# EAGLE design uCopter (EAGLE 7.5.0)
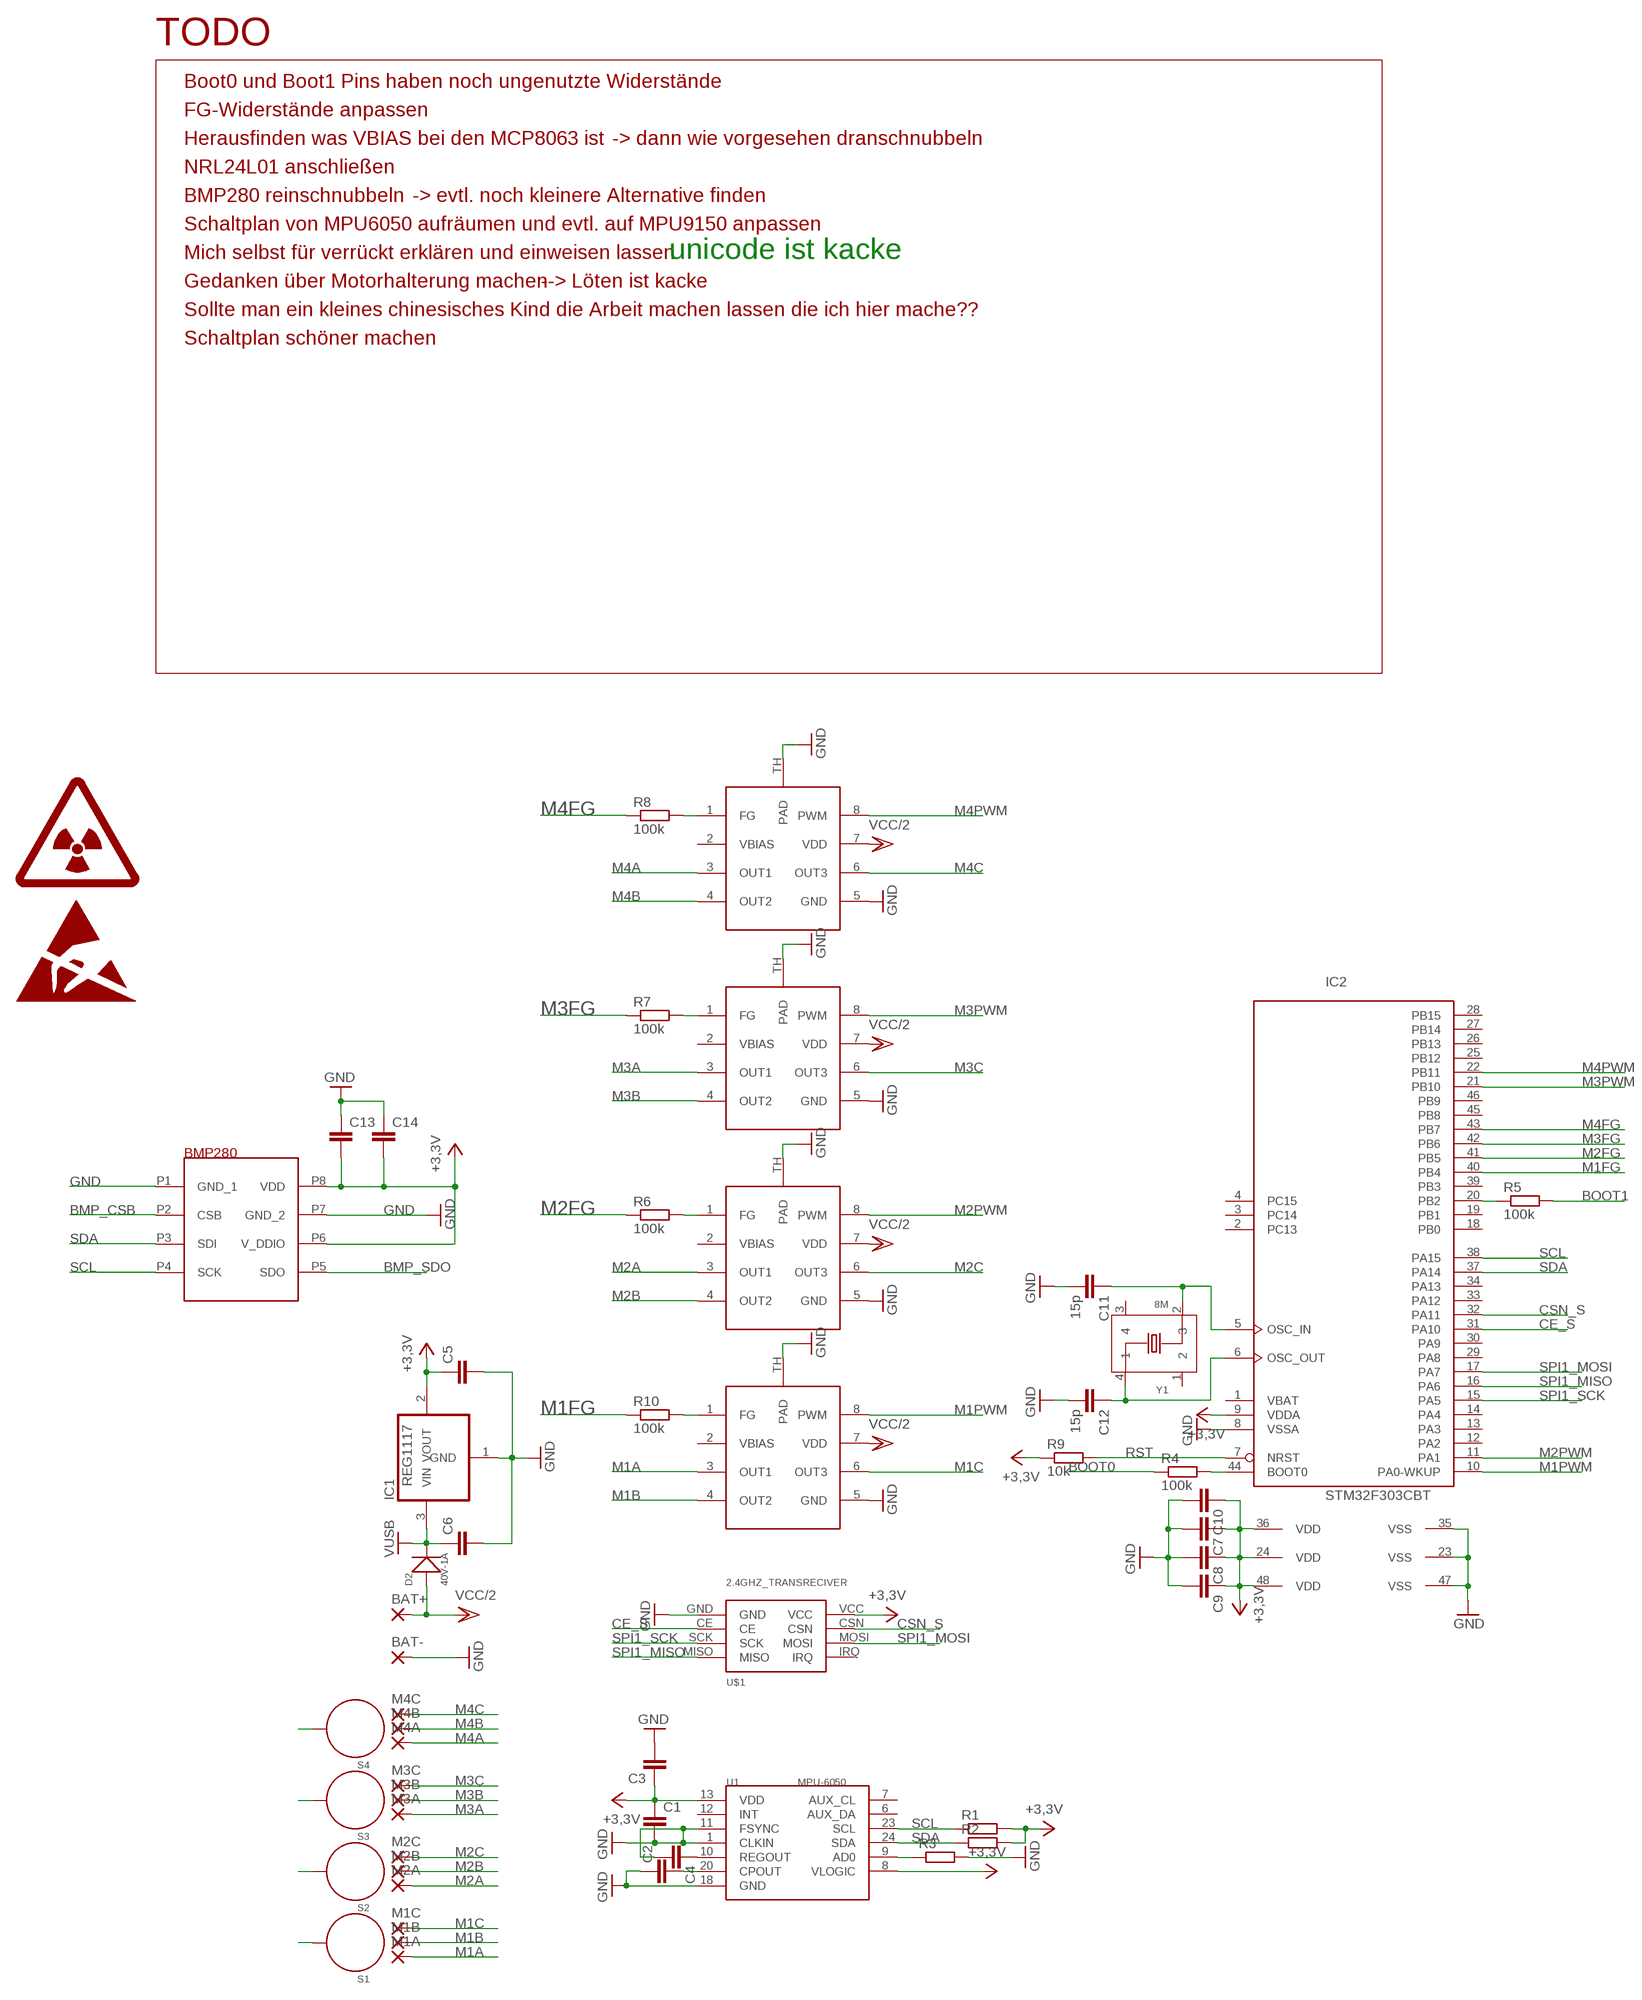
[diagram p0: schematic, sheet 1]

## Parts
BAT+  SMD2  [SMD1,27-2,54]
BAT-  SMD2  [SMD1,27-2,54]
C1  C-EUC0402  [C0402]
C2  C-EUC0402  [C0402]
C3  C-EUC0402  [C0402]
C4  C-EUC0402  [C0402]
C5  C-EUC0603  [C0603]
C6  C-EUC0603  [C0603]
C7  C-EUC0402  [C0402]
C8  C-EUC0402  [C0402]
C9  C-EUC0402  [C0402]
C10  C-EUC0402  [C0402]
C11  15p  C-EUC0402  [C0402]
C12  15p  C-EUC0402  [C0402]
C13  C-EUC0402  [C0402]
C14  C-EUC0402  [C0402]
D2  40V-1A  SMD-DIODE-SCHOTTKY-40V-1A(DO-214AC)  [DO-214AC]
IC1  REG1117  [SOT223]
IC2  STM32F303CBT  [LQFP48]
M1A  2,15/1,0  [2,15/1,0]
M1B  2,15/1,0  [2,15/1,0]
M1C  2,15/1,0  [2,15/1,0]
M2A  2,15/1,0  [2,15/1,0]
M2B  2,15/1,0  [2,15/1,0]
M2C  2,15/1,0  [2,15/1,0]
M3A  2,15/1,0  [2,15/1,0]
M3B  2,15/1,0  [2,15/1,0]
M3C  2,15/1,0  [2,15/1,0]
M4A  2,15/1,0  [2,15/1,0]
M4B  2,15/1,0  [2,15/1,0]
M4C  2,15/1,0  [2,15/1,0]
R1  R-EU_R0402  [R0402]
R2  R-EU_R0402  [R0402]
R3  R-EU_R0402  [R0402]
R4  100k  R-EU_R0402  [R0402]
R5  100k  R-EU_R0402  [R0402]
R6  100k  R-EU_R0402  [R0402]
R7  100k  R-EU_R0402  [R0402]
R8  100k  R-EU_R0402  [R0402]
R9  10k  R-EU_R0402  [R0402]
R10  100k  R-EU_R0402  [R0402]
S1  STANDOFF_ELECTRICAL  [STANDOFF-ELECTRICAL]
S2  STANDOFF_ELECTRICAL  [STANDOFF-ELECTRICAL]
S3  STANDOFF_ELECTRICAL  [STANDOFF-ELECTRICAL]
S4  STANDOFF_ELECTRICAL  [STANDOFF-ELECTRICAL]
T1  BMP280  [BMP280]
U1  MPU-6050  MOTION/POSITION-MPU-6050(QFN24)  [QFN24G-0.5-4X4MM]
U$1  2.4GHZ_TRANSRECIVER  [2.4GHZ_TRANSRECIVER]
U$6  MCP8063  [DFN8-4X4]
U$7  MCP8063  [DFN8-4X4]
U$8  MCP8063  [DFN8-4X4]
U$9  MCP8063  [DFN8-4X4]
Y1  8M  SMD-CRYSTAL-27.12MHZ-18PF-30PPM-60R(4P-3.2X2.5MM)  [X4-SMD-3.2X2.5X0.7MM]

## Nets
+3,3V: C1.1 C3.1 C5.1 C7.1 C8.1 C9.1 C10.1 C13.2 C14.2 IC1.2(VOUT) IC2.9(VDDA) IC2.24(VDD) IC2.36(VDD) IC2.48(VDD) R1.2 R2.2 R9.1 T1.P6(V_DDIO) T1.P8(VDD) U1.8(VLOGIC) U1.13(VDD) U$1.VCC
BMP_CSB: T1.P2(CSB)
BMP_SDO: T1.P5(SDO)
BOOT0: R4.1
BOOT1: R5.2
CE_S: IC2.31(PA10) U$1.CE
CSN_S: IC2.32(PA11) U$1.CSN
GND: BAT-.1(P) C1.2 C2.1 C3.2 C4.2 C5.2 C6.2 C7.2 C8.2 C9.2 C10.2 C11.2 C12.2 C13.1 C14.1 IC1.1(GND) IC2.8(VSSA) IC2.23(VSS) IC2.35(VSS) IC2.47(VSS) R3.2 T1.P1(GND_1) T1.P7(GND_2) U1.1(CLKIN) U1.11(FSYNC) U1.18(GND) U$1.GND U$6.5(GND) U$6.TH(PAD) U$7.5(GND) U$7.TH(PAD) U$8.5(GND) U$8.TH(PAD) U$9.5(GND) U$9.TH(PAD)
M1A: M1A.1(P) U$6.3(OUT1)
M1B: M1B.1(P) U$6.4(OUT2)
M1C: M1C.1(P) U$6.6(OUT3)
M1FG: IC2.40(PB4) R10.1
M1PWM: IC2.10(PA0-WKUP) U$6.8(PWM)
M2A: M2A.1(P) U$7.3(OUT1)
M2B: M2B.1(P) U$7.4(OUT2)
M2C: M2C.1(P) U$7.6(OUT3)
M2FG: IC2.41(PB5) R6.1
M2PWM: IC2.11(PA1) U$7.8(PWM)
M3A: M3A.1(P) U$8.3(OUT1)
M3B: M3B.1(P) U$8.4(OUT2)
M3C: M3C.1(P) U$8.6(OUT3)
M3FG: IC2.42(PB6) R7.1
M3PWM: IC2.21(PB10) U$8.8(PWM)
M4A: M4A.1(P) U$9.3(OUT1)
M4B: M4B.1(P) U$9.4(OUT2)
M4C: M4C.1(P) U$9.6(OUT3)
M4FG: IC2.43(PB7) R8.1
M4PWM: IC2.22(PB11) U$9.8(PWM)
N$1: S4.P1
N$2: S3.P1
N$3: S2.P1
N$4: S1.P1
N$5: R7.2 U$8.1(FG)
N$6: R8.2 U$9.1(FG)
N$7: C4.1 U1.10(REGOUT)
N$8: C2.2 U1.20(CPOUT)
N$9: R3.1 U1.9(AD0)
N$10: IC2.44(BOOT0) R4.2
N$11: IC2.20(PB2) R5.1
N$12: R10.2 U$6.1(FG)
N$13: C12.1 IC2.6(OSC_OUT) Y1.4
N$14: R6.2 U$7.1(FG)
N$17: C11.1 IC2.5(OSC_IN) Y1.2
RST: IC2.7(NRST) R9.2
SCL: IC2.38(PA15) R1.1 T1.P4(SCK) U1.23(SCL)
SDA: IC2.37(PA14) R2.1 T1.P3(SDI) U1.24(SDA)
SPI1_MISO: IC2.16(PA6) U$1.MISO
SPI1_MOSI: IC2.17(PA7) U$1.MOSI
SPI1_SCK: IC2.15(PA5) U$1.SCK
VCC/2: BAT+.1(P) D2.1(+) U$6.7(VDD) U$7.7(VDD) U$8.7(VDD) U$9.7(VDD)
VUSB: C6.1 D2.2(-) IC1.3(VIN)
Unconnected: IC2.2(PC13) IC2.3(PC14) IC2.4(PC15) IC2.12(PA2) IC2.13(PA3) IC2.14(PA4) IC2.18(PB0) IC2.19(PB1) IC2.25(PB12) IC2.26(PB13) IC2.27(PB14) IC2.28(PB15) IC2.29(PA8) IC2.30(PA9) IC2.33(PA12) IC2.34(PA13) IC2.39(PB3) IC2.45(PB8) IC2.46(PB9) U1.6(AUX_DA) U1.7(AUX_CL) U1.12(INT) U$1.IRQ U$6.2(VBIAS) U$7.2(VBIAS) U$8.2(VBIAS) U$9.2(VBIAS) Y1.1 Y1.3

## Notes on the sheet
- TODO
- Boot0 und Boot1 Pins haben noch ungenutzte Widerstände
- FG-Widerstände anpassen
- Herausfinden was VBIAS bei den MCP8063 ist | -> dann wie vorgesehen dranschnubbeln
- NRL24L01 anschließen
- BMP280 reinschnubbeln | -> evtl. noch kleinere Alternative finden
- Schaltplan von MPU6050 aufräumen und evtl. auf MPU9150 anpassen
- Mich selbst für verrückt erklären und einweisen lassen | unicode ist kacke
- Gedanken über Motorhalterung machen | --> Löten ist kacke
- Sollte man ein kleines chinesisches Kind die Arbeit machen lassen die ich hier mache??
- Schaltplan schöner machen

## Power pins joined to a net without a drawn wire
VBAT: IC2.1(VBAT)

## Library data of the parts
BAT+ BAT- = wirepad:SMD2: SMD PAD
C1-C14 = rcl:C-EU: CAPACITOR, European symbol
D2 = Seeed-OPL-Diode:SMD-DIODE-SCHOTTKY-40V-1A(DO-214AC): 304020027; MPN: 1N5819
IC1 = burr-brown:REG1117: 800mA and 1A Low Dropout (LDO) Positive Regulator 1.8V, 2.5V, 2.85V, 3.3V, 5V, and Adj
IC2 = micro-stm_v2:STM32F303C*T: ARM 32-bit Cortex™-M3 CPU 72 MHz maximum frequency 128 to 256 Kbytes of Flash memory 32 to 40 kbytes of SRAM 37 GPIOs 2.0 to 3.6 V application supply
M1A M1B M1C M2A M2B M2C M3A M3B M3C M4A M4B M4C = wirepad:2,15/1,0: THROUGH-HOLE PAD
R1-R10 = rcl:R-EU_: RESISTOR, European symbol
S1-S4 = SparkFun-Electromechanical:STANDOFF_ELECTRICAL: A standoff intended to be an electrically connected point. Pad size and stop size allow for a #4 Phillips pan screw head to make a solid connection to the board.
T1 = BOSCH-Testbuilds:BMP280: Test-Foodprint BMP280
U1 = Seeed-OPL-sensor:MOTION/POSITION-MPU-6050(QFN24): 314080000; MPN: MPU-6050
U$1 = 2_4GHZTransreciver:2.4GHZ_TRANSRECIVER
U$6-U$9 = mcp8063:MCP8063
Y1 = Seeed-OPL-Crystal-Oscillator:SMD-CRYSTAL-27.12MHZ-18PF-30PPM-60R(4P-3.2X2.5MM): 306010027; MPN: 7M-27.120MAAJ-T; VALUE: 27.12MHZ

## Board
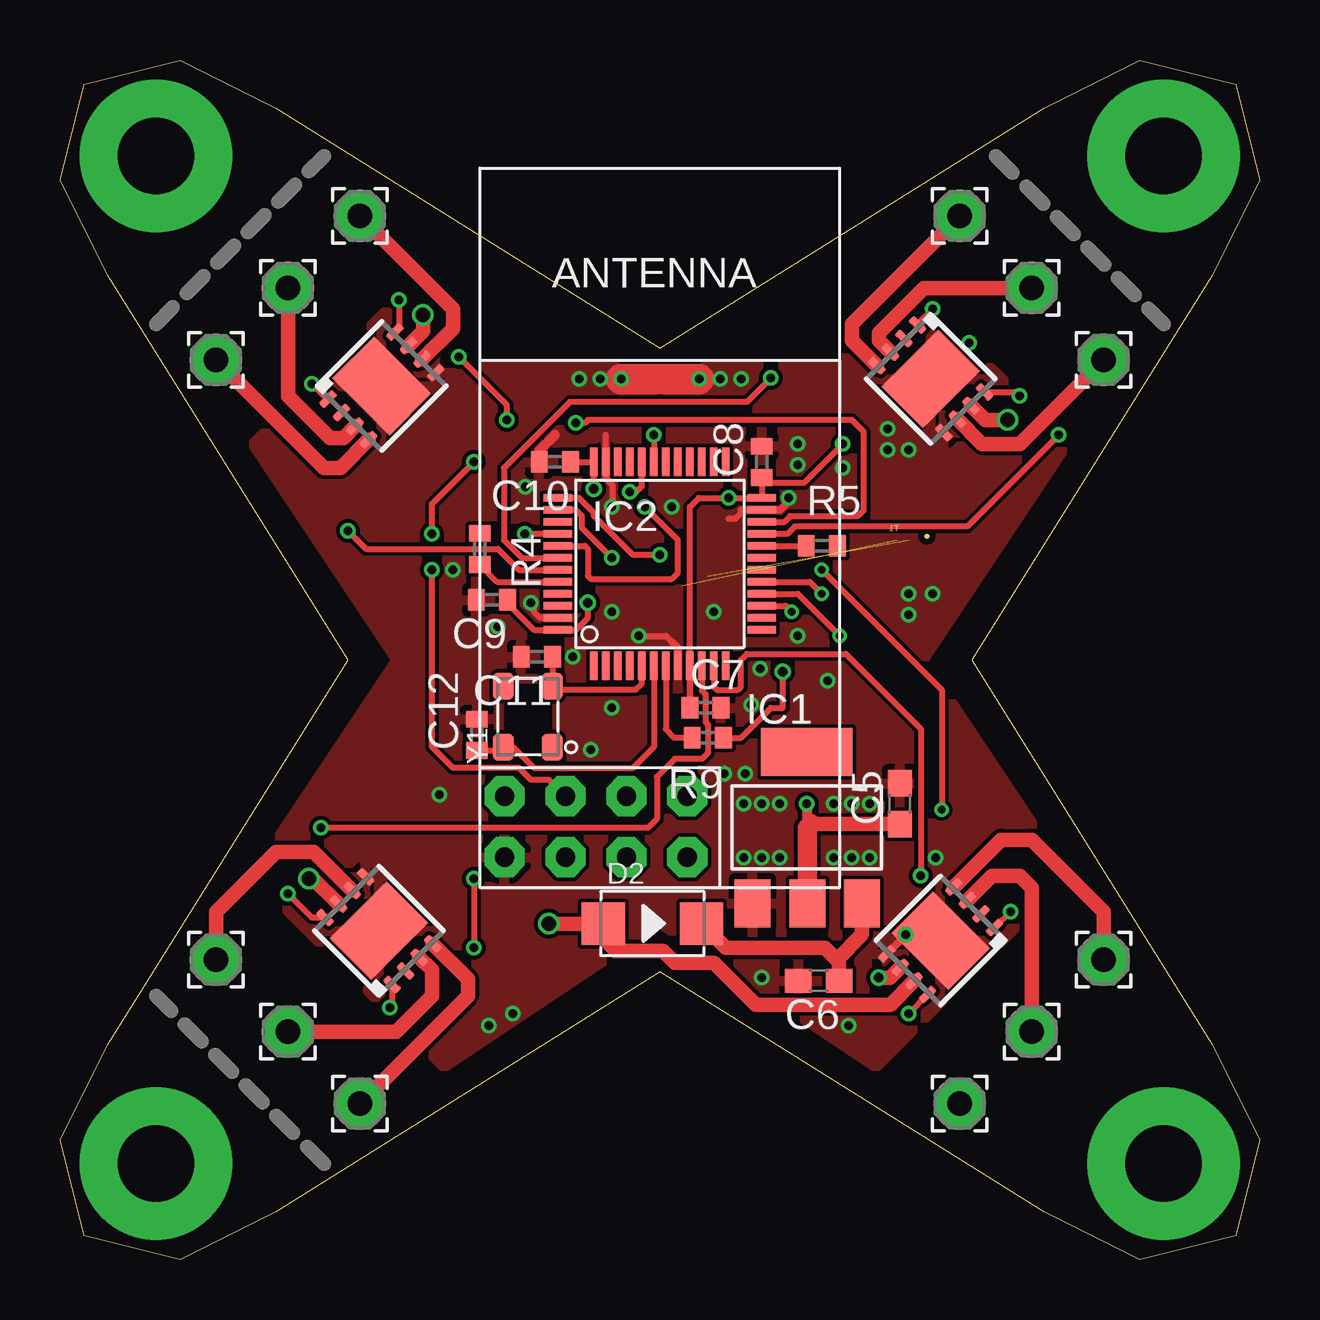
[diagram p1: board, top side]
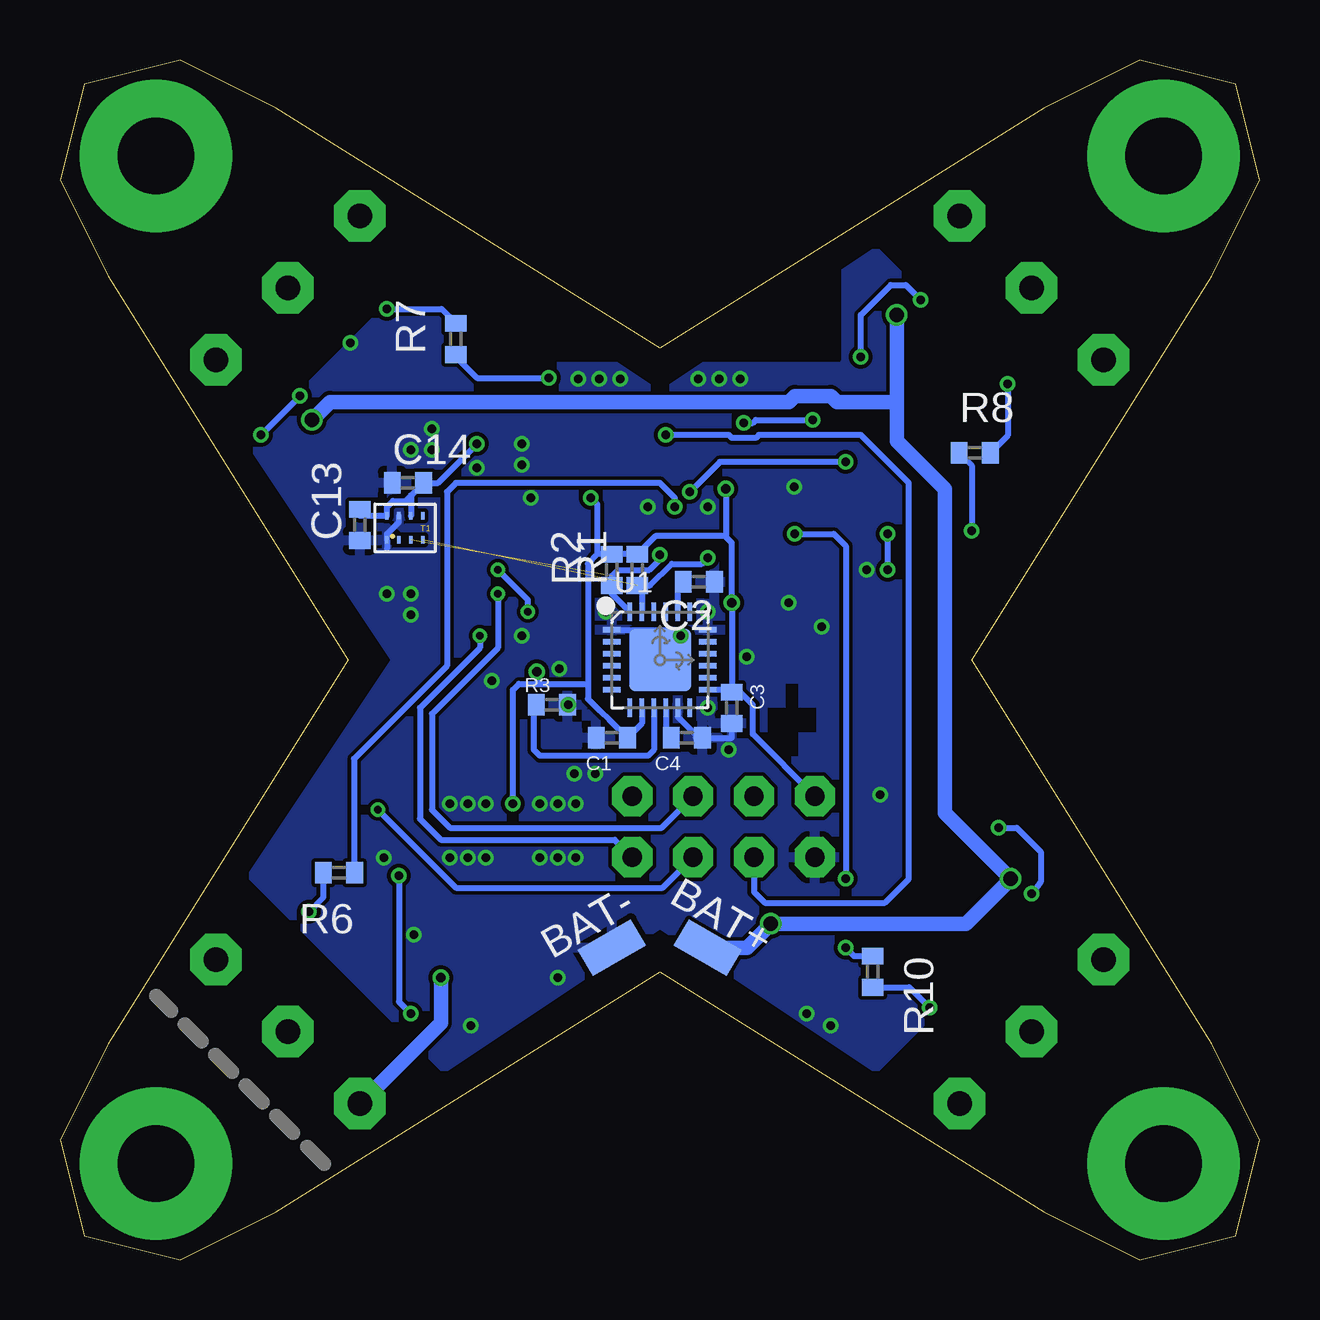
[diagram p2: board, bottom side, seen from below]

Size 50 x 50 mm. Coordinates in mm from the lower left corner, seen from the top.
Outline: 1,49 5,50 9,48 25,38 41,48 45,50 49,49 50,45 48,41 38,25 48,9 50,5 49,1 45,0 41,2 25,12 9,2 5,0 1,1 0,5 2,9 12,25 2,41 0,45 1,49
Copper layers (1*16): Top 0.035mm / dielectric 1.5mm / Bottom 0.035mm
Design rules "ITEADstudio_DRC": minimum track width 6mil, minimum drill 12mil, track to track 6mil, track to pad 6mil, pad to pad 6mil, via to via 6mil, smd to smd 0mil, copper to edge 10mil, drill to drill 10mil, minimum pad ring 10mil, minimum via ring 6mil, stop-mask expansion 2mil, vias tented up to drill 100mil, thermal gap 10mil
tRestrict: area 18.5,21 to 20.5,24
bRestrict: area 18.5,21 to 20.5,24

### Footprints (pad centres in the part's own frame; a part is rotated, then mirrored left to right if it is on the bottom)
SMD1,27-2,54 = smd 1.27 x 2.54: 1 0,0
C0402 = smd 0.7 x 0.9: 1 -0.65,0; 2 0.65,0
C0603 = smd 1.1 x 1: 1 -0.85,0; 2 0.85,0
DO-214AC = smd 1.8 x 1.77: 1 -2.042,0; 2 2.042,0
SOT223 = smd 1.499 x 2.007: 1 -2.261,-3.15; 2 0.025,-3.15; 3 2.311,-3.15 | smd 3.81 x 2.007: 4 0,3.15
LQFP48 = smd 0.3 x 1.2: 1 -2.75,-4.25; 2 -2.25,-4.25; 3 -1.75,-4.25; 4 -1.25,-4.25; 5 -0.75,-4.25; 6 -0.25,-4.25; 7 0.25,-4.25; 8 0.75,-4.25; 9 1.25,-4.25; 10 1.75,-4.25; 11 2.25,-4.25; 12 2.75,-4.25; 25 2.75,4.25; 26 2.25,4.25; 27 1.75,4.25; 28 1.25,4.25; 29 0.75,4.25; 30 0.25,4.25; 31 -0.25,4.25; 32 -0.75,4.25; 33 -1.25,4.25; 34 -1.75,4.25; 35 -2.25,4.25; 36 -2.75,4.25 | smd 1.2 x 0.3: 13 4.25,-2.75; 14 4.25,-2.25; 15 4.25,-1.75; 16 4.25,-1.25; 17 4.25,-0.75; 18 4.25,-0.25; 19 4.25,0.25; 20 4.25,0.75; 21 4.25,1.25; 22 4.25,1.75; 23 4.25,2.25; 24 4.25,2.75; 37 -4.25,2.75; 38 -4.25,2.25; 39 -4.25,1.75; 40 -4.25,1.25; 41 -4.25,0.75; 42 -4.25,0.25; 43 -4.25,-0.25; 44 -4.25,-0.75; 45 -4.25,-1.25; 46 -4.25,-1.75; 47 -4.25,-2.25; 48 -4.25,-2.75
2,15/1,0 = drill 1.016 pad 2.159 octagon: 1 0,0
R0402 = smd 0.7 x 0.9: 1 -0.65,0; 2 0.65,0
STANDOFF-ELECTRICAL = drill 3.2 pad 6.35: P1 0,0
BMP280 = smd 0.305 x 0.152: P1 -0.5,0.5; P2 -0.5,0; P3 -0.5,-0.5; P4 -0.5,-1; P5 0.5,-1; P6 0.5,-0.5; P7 0.5,0; P8 0.5,0.5
QFN24G-0.5-4X4MM = smd 0.8 x 0.26: 1 -2,1.25; 2 -2,0.75; 3 -2,0.25; 4 -2,-0.25; 5 -2,-0.75; 6 -2,-1.25; 13 2,-1.25; 14 2,-0.75; 15 2,-0.25; 16 2,0.25; 17 2,0.75; 18 2,1.25 | smd 0.26 x 0.8: 7 -1.25,-2; 8 -0.75,-2; 9 -0.25,-2; 10 0.25,-2; 11 0.75,-2; 12 1.25,-2; 19 1.25,2; 20 0.75,2; 21 0.25,2; 22 -0.25,2; 23 -0.75,2; 24 -1.25,2 | smd 2.6 x 2.6: E 0.02,-0.01
2.4GHZ_TRANSRECIVER = drill 0.8 pad 1.676 octagon: CE 1.27,11.43; CSN 3.81,11.43; GND 1.27,13.97; IRQ 3.81,6.35; MISO 1.27,6.35; MOSI 3.81,8.89; SCK 1.27,8.89; VCC 3.81,13.97
DFN8-4X4 = smd 0.35 x 0.8: 1 -1.2,-1.975; 2 -0.4,-1.975; 3 0.4,-1.975; 4 1.2,-1.975; 5 1.2,1.975; 6 0.4,1.975; 7 -0.4,1.975; 8 -1.2,1.975 | smd 3.38 x 2.45: TH 0,0
X4-SMD-3.2X2.5X0.7MM = smd 1.143 x 0.889: 1 -1.27,-1.016; 2 1.27,-1.016; 3 1.27,1.016; 4 -1.27,1.016

### Placement (x,y rotation side)
BAT+  23,13 240 bottom
BAT-  27,13 300 bottom
C1  27,21.75 180 bottom
C2  23.38,28.25 180 bottom
C3  22,23 270 bottom
C4  23.88,21.75 0 bottom
C5  35,19 90 top
C6  31.62,11.62 180 top
C7  26.91,23 0 top
C8  29.25,33.25 90 top
C9  18,27.5 180 top
C10  20.62,33.25 180 top
C11  19.88,25.12 180 top
C12  17.38,21.88 90 top
C13  37.5,30.62 90 bottom
C14  35.5,32.38 0 bottom
D2  24.69,14.01 0 top
IC1  31.12,18 0 top
IC2  25,29 0 top
M1A  9.5,9.5 0 top
M1B  12.5,6.5 0 top
M1C  6.5,12.5 0 top
M2A  40.5,9.5 0 top
M2B  43.5,12.5 0 top
M2C  37.5,6.5 0 top
M3A  40.5,40.5 0 top
M3B  37.5,43.5 0 top
M3C  43.5,37.5 0 top
M4A  9.5,40.5 0 top
M4B  6.5,37.5 0 top
M4C  12.5,43.5 0 top
R1  25.94,28.75 90 bottom
R2  27,28.75 90 bottom
R3  29.5,23.12 0 bottom
R4  17.5,29.62 270 top
R5  31.75,29.75 0 top
R6  38.38,16.12 180 bottom
R7  33.5,38.38 90 bottom
R8  11.88,33.62 0 bottom
R9  27,21.75 180 top
R10  16.12,12 270 bottom
S1  4,4 0 top
S2  46,4 0 top
S3  4,46 0 top
S4  46,46 0 top
T1  35.88,30.5 90 bottom
U1  25,25 0 bottom
U$1  32.5,15.5 90 top
U$6  13.29,13.71 45 top
U$7  36.71,13.29 135 top
U$8  36.29,36.71 225 top
U$9  13.41,36.41 315 top
Y1  19.5,22.62 90 top

### Tracks (layer width: path | path; a pad name or v marks a point on that pad's centre or on a via)
+3,3V  (via drill 0.35, 0.35 pad 0.25, 0.4)
  Top 0.254: C9.1 18.65,27.35 19.75,26.25 IC2.48 21.5,26.25 22,26.75 v22,27.38 | C10.1 IC2.36 v22.25,32.12 | IC2.9 C7.1 26.25,31.38 26.62,31.75 v27.88,31.75 IC2.24 C8.1 29.48,32.38 31,32.38 v32.62,34 | R9.1 28.38,21.75 29.62,23 30.12,23 v30.12,24.5
  Top 0.406: 31.15,18 31.15,18.98 v31.12,19
  Top 0.61: 31.3,18.15 C5.1
  Top 0.813: 31.3,18.15 31.15,18 IC1.2
  Bottom 0.254: U1.8 25.75,22.35 C1.1 27.1,22.5 27.5,22.88 28,23.38 28,24 | C3.1 22.1,23.75 U1.13 | 22.27,30.15 22,29.88 v22,27.38 C3.1 | 27.6,29.4 R2.2 R1.2 25.19,30.15 22.27,30.15 | 27.6,29.4 28,29 28,24 | v31.12,19 31.12,23.75 30.88,24 30.12,24 | 30.12,24 28,24 | v22.25,32.12 22.25,30.18 22.27,30.15 | v30.12,24.5 30.12,24 | 27.6,29.4 27.6,31.48 v27.88,31.75 | U$1.VCC 21.12,21.91 21.12,23.12 21.65,23.65 C3.1 | C13.2 37.5,31 T1.P8 36.38,31.38 36.12,31.62 35.6,31.62 35.38,31.85 | 35.38,31.85 C14.2 34.25,32.38 v32.62,34 | 35.38,31.85 T1.P6
BOOT1
  Top 0.254: R5.2 32.15,29.98
CE_S  (via drill 0.35)
  Top 0.254: v24.75,34.38 IC2.31
  Bottom 0.254: U$1.CE 21.07,15.32 20.62,14.88 15.62,14.88 14.62,15.88 14.62,32.38 16.62,34.38 20.88,34.38 21,34.25 22,34.25 22.12,34.38 v24.75,34.38
CSN_S  (via drill 0.35)
  Top 0.254: U$1.CSN 20.38,20 19.62,20 19.12,20.5 16.38,20.5 15.5,21.38 v15.5,28.75 | v15.5,30.25 15.5,31.5 v17.25,33.25 | v23.75,32 24,32 24.25,32.25 IC2.32
  Bottom 0.254: v15.5,28.75 v15.5,30.25 | v17.25,33.25 22.5,33.25 v23.75,32
GND  (via drill 0.35)
  Top 0.254: 28.5,31.25 28.38,31.25 | IC2.47 20,26.75 19.75,27 19.75,27.25 v19.62,27.38 | IC2.23 28.5,31.25 | 28.5,31.25 28.12,30.88 27.88,30.88 | 22.75,34.38 IC2.35 22.75,32.56 23.03,32.28 23.03,31.78 v23,31.38 | v24.12,26 25.25,26 25.75,25.5 | v30.38,31.75 30.38,31.62
  Top 0.305: U$7.5 v35.26,13.54 v35.25,13.54 | IC2.23 30,31.25 30.38,31.62 | IC2.8 25.75,25.5 25.5,25.75
  Top 0.406: 20.62,34.38 20,33.75 20,33.27 C10.2
  Top 0.61: U$7.TH 35.5,13.29 v35.25,13.54
  Top 1.27: v23.39,36.7 v26.64,36.7
  Bottom 0.254: U1.11 24.25,22.62 23.5,21.88 23.5,21.75 C4.2 22,21.75 C3.2 | U1.1 24.38,26.25 v24.12,26 | 36.38,29.62 T1.P1 36.38,30.25 35.88,30.75 T1.P7
  other vias: 23,27 27.25,27 27.69,20.25 28.5,16.75 29.25,16.75 30,16.75 32.25,16.75 33,16.75 33.75,16.75 33.75,19 33,19 32.25,19 29.25,19 28.5,19 30,19 32.88,9.75 18.88,10.25 17.88,9.75 23,23 25.5,31.38 16.38,28.75 36.38,27.75 30.75,33.12 32.62,33 30.75,34 36.5,16.75 29.25,11.75 37.89,38.2 22.52,36.7 27.52,36.7 28.39,36.7 21.64,36.7 32,24.12 35.38,27.75 35.38,26.88 34.5,34.62 35.38,33.75 34.5,33.75 19.39,32.2 21.38,25.12 28.56,20.25 15.81,19.38 29.19,24.62 28.81,23.12 22.12,21.25 30.75,26 18.25,26.38
  pour Bottom: 8,16 14,25 8,34 16,42 25,36 34,42 42,34 36,25 42,16 34,8 25,14 16,8
  pour Top: 42,16 36,25 42,34 34,42 25,36 16,42 8,34 14,25 8,16 16,8 25,14 34,8
M1A
  Top 0.61: M1A.1 14,9.5 15.5,11 15.5,12.07 U$6.3
M1B
  Top 0.61: M1B.1 17,11 17,11.7 U$6.4
M1C
  Top 0.61: M1C.1 6.5,14.5 9,17 10.57,17 U$6.6
M1FG  (via drill 0.35)
  Top 0.254: IC2.40 v19.38,30.25 | v17.25,15.88 v17.25,13
  Bottom 0.254: v19.38,30.25 17.75,30.25 17.25,29.75 v17.25,15.88 | v17.25,13 16.9,12.65 R10.1
M1PWM  (via drill 0.35)
  Top 0.254: IC2.10 26.75,23.72 26.91,23.56 26.91,22.41 27,22.31 27,21.12 26.75,20.88 25.62,20.88 24.88,20.12 24.88,18.38 24.5,18 v10.88,18 | v9.5,15.25 10.49,14.26 U$6.8
  Bottom 0.254: v10.88,18 10.12,18 9.12,17 9.12,15.75 v9.5,15.25
M2A
  Top 0.61: M2A.1 40.5,15.5 40,16 38.85,16 U$7.3
M2B
  Top 0.61: M2B.1 43.5,14.5 40.5,17.5 39.22,17.5 U$7.4
M2C  (via drill 0.4)
  Top 0.61: 34.5,11.75 v34.12,11.75 34.6,11.75 U$7.6
  Bottom 0.61: M2C.1 34.12,9.88 v34.12,11.75
M2FG  (via drill 0.35)
  Top 0.254: IC2.41 21.88,29.75 22,29.62 22,28.5 22.12,28.38 25.5,28.38 25.75,28.62 25.75,30 v24.38,31.38
  Bottom 0.254: v24.38,31.38 24.38,31.75 25,32.38 33.5,32.38 33.88,32 33.88,24.75 37.75,20.88 37.75,16.15 R6.1
M2PWM  (via drill 0.35)
  Top 0.254: IC2.11 27.25,23.88 27.38,23.75 28.25,23.75 28.38,23.88 28.38,25 28.62,25.25 32.75,25.25 35.88,22.12 v35.88,16 | v35.38,10.25 35.38,10.26 U$7.8
  Bottom 0.254: v35.88,16 35.88,10.75 v35.38,10.25
M3A
  Top 0.61: M3A.1 36,40.5 34.12,38.62 34.12,38.31 U$8.3
M3B
  Top 0.61: M3B.1 33,39 33,38.3 U$8.4
M3C
  Top 0.61: M3C.1 40,34 38.43,34 U$8.6
M3FG  (via drill 0.35)
  Top 0.254: v29.62,36.75 28.62,35.75 21.25,35.75 18.5,33 18.5,30 19.25,29.25 IC2.42
  Bottom 0.254: R7.1 33.5,37.62 32.62,36.75 v29.62,36.75
M3PWM  (via drill 0.35)
  Top 0.254: U$8.8 39.84,36.16 v40,36 | v41.62,34.38 37.81,30.56 30.62,30.56 30.31,30.25 IC2.21
  Bottom 0.254: v40,36 v41.62,34.38
M4A
  Top 0.61: M4A.1 9.5,36 11.25,34.25 11.82,34.25 U$9.3
M4B
  Top 0.61: M4B.1 11,33 11.7,33 U$9.4
M4C
  Top 0.61: M4C.1 16.38,39.62 16.38,38.81 U$9.6
M4FG  (via drill 0.35)
  Top 0.254: v12,30.38 12.75,29.62 18.25,29.62 19.12,28.75 IC2.43
  Bottom 0.254: R8.1 12,33.1 v12,30.38
M4PWM  (via drill 0.35)
  Top 0.254: IC2.22 30.19,30.75 30.44,31 33.25,31 33.5,31.25 33.5,34.5 33,35 22,35 21.88,34.88 v21.5,34.88 | v18.62,35 18.62,35.62 v16.62,37.62 | v14.12,40 14.12,38.82 U$9.8
  Bottom 0.254: v21.5,34.88 21.12,34.88 21,35 v18.62,35 | v16.62,37.62 16.62,39.38 15.38,40.62 14.75,40.62 v14.12,40
N$5  (via drill 0.35)
  Top 0.254: U$8.1 35.74,38.99 v36.38,39.62
  Bottom 0.254: v36.38,39.62 34.1,39.62 R7.2
N$6  (via drill 0.35)
  Top 0.254: U$9.1 11.13,35.87 v10.5,36.5
  Bottom 0.254: v10.5,36.5 10.5,34.35 R8.2
N$7
  Bottom 0.254: U1.10 24.75,21.9 C4.1
N$8
  Bottom 0.254: U1.20 24.25,27.9 C2.2
N$9
  Bottom 0.254: U1.9 25.25,21.25 25.5,21 30,21 30.25,21.25 30.25,23.02 R3.1
N$10
  Top 0.254: R4.2 18.23,28.25 IC2.44
N$11
  Top 0.254: IC2.20 R5.1
N$12  (via drill 0.35)
  Top 0.254: U$6.1 13.84,10.59 v13.75,10.5
  Bottom 0.254: R10.2 14.6,11.35 v13.75,10.5
N$13
  Top 0.254: C12.1 18.48,21.23 Y1.4 18.89,21.36 19.75,20.5 23.88,20.5 24.75,21.38 IC2.6
N$14  (via drill 0.35)
  Top 0.254: U$7.1 38.97,13.84 v39.62,14.5
  Bottom 0.254: v39.62,14.5 39.02,15.1 R6.2
N$17
  Top 0.254: IC2.5 24.25,24 24.02,23.77 20.64,23.77 Y1.2 20.52,23.78 C11.1
RST
  Top 0.254: IC2.7 25.25,22.1 25.6,21.75 R9.2
SCL  (via drill 0.35)  (1 unrouted)
  Top 0.254: v23,29.25 21.75,30.5 21.75,31 21.5,31.25 IC2.38
  Bottom 0.254: U1.23 25.75,28 25.85,28.1 R1.1 25.4,28.1 24.5,29 23.25,29 v23,29.25
SDA  (via drill 0.35)  (1 unrouted)
  Top 0.254: v25,29.38 23.88,29.38 22.25,31 22.25,31.12 21.62,31.75 IC2.37
  Bottom 0.254: U1.24 27,27.75 R2.1 27,28.5 26.75,28.75 25.44,28.75 25,29.19 v25,29.38
SPI1_MISO  (via drill 0.3)
  Top 0.254: IC2.16 30.75,27.75 v32.5,26
  Bottom 0.254: v32.5,26 32.5,25.5 35,23 35,18.38 34.12,17.5 26.88,17.5 U$1.MISO
SPI1_MOSI  (via drill 0.3)
  Top 0.254: IC2.17 31.25,28.25 v31.75,27.75
  Bottom 0.254: v31.75,27.75 31.75,25.5 34.5,22.75 34.5,18.75 33.75,18 24.92,18 U$1.MOSI
SPI1_SCK  (via drill 0.3)
  Top 0.254: IC2.15 30.25,27.25 v30.5,27 | v31.75,28.75 36.75,23.75 v36.75,18.75
  Bottom 0.254: v30.5,27 30.5,27.5 v31.75,28.75 | v36.75,18.75 33.5,15.5 24.88,15.5 U$1.SCK
VCC/2  (via drill 0.6)
  Top 0.61: v20.38,14 D2.1 22.65,13.4 23.12,12.88 25.12,12.88 25.62,12.38 27.25,12.38 29,10.62 34.6,10.62 U$7.7 | v10.38,15.88 10.56,15.88 U$6.7 | U$9.7 15.12,38.69 v15.12,39.38 | U$8.7 38.57,35 v39.5,35
  Bottom 0.61: BAT+.1 21.38,13 v20.38,14 12.25,14 v10.38,15.88 13.12,18.62 13.12,32.12 15.12,34.12 15.12,35.75 | v15.12,39.38 15.12,35.75 | v39.5,35 38.75,35.75 19.62,35.75 19.38,36 17.88,36 17.62,35.75 15.12,35.75
VUSB
  Top 0.61: D2.2 27.75,13 31.88,13 32.38,12.5 | 32.38,12.5 32.48,12.4 C6.1 | IC1.3 33.44,13.56 32.38,12.5